# EAGLE design linear supply2 (EAGLE 9.6.2)
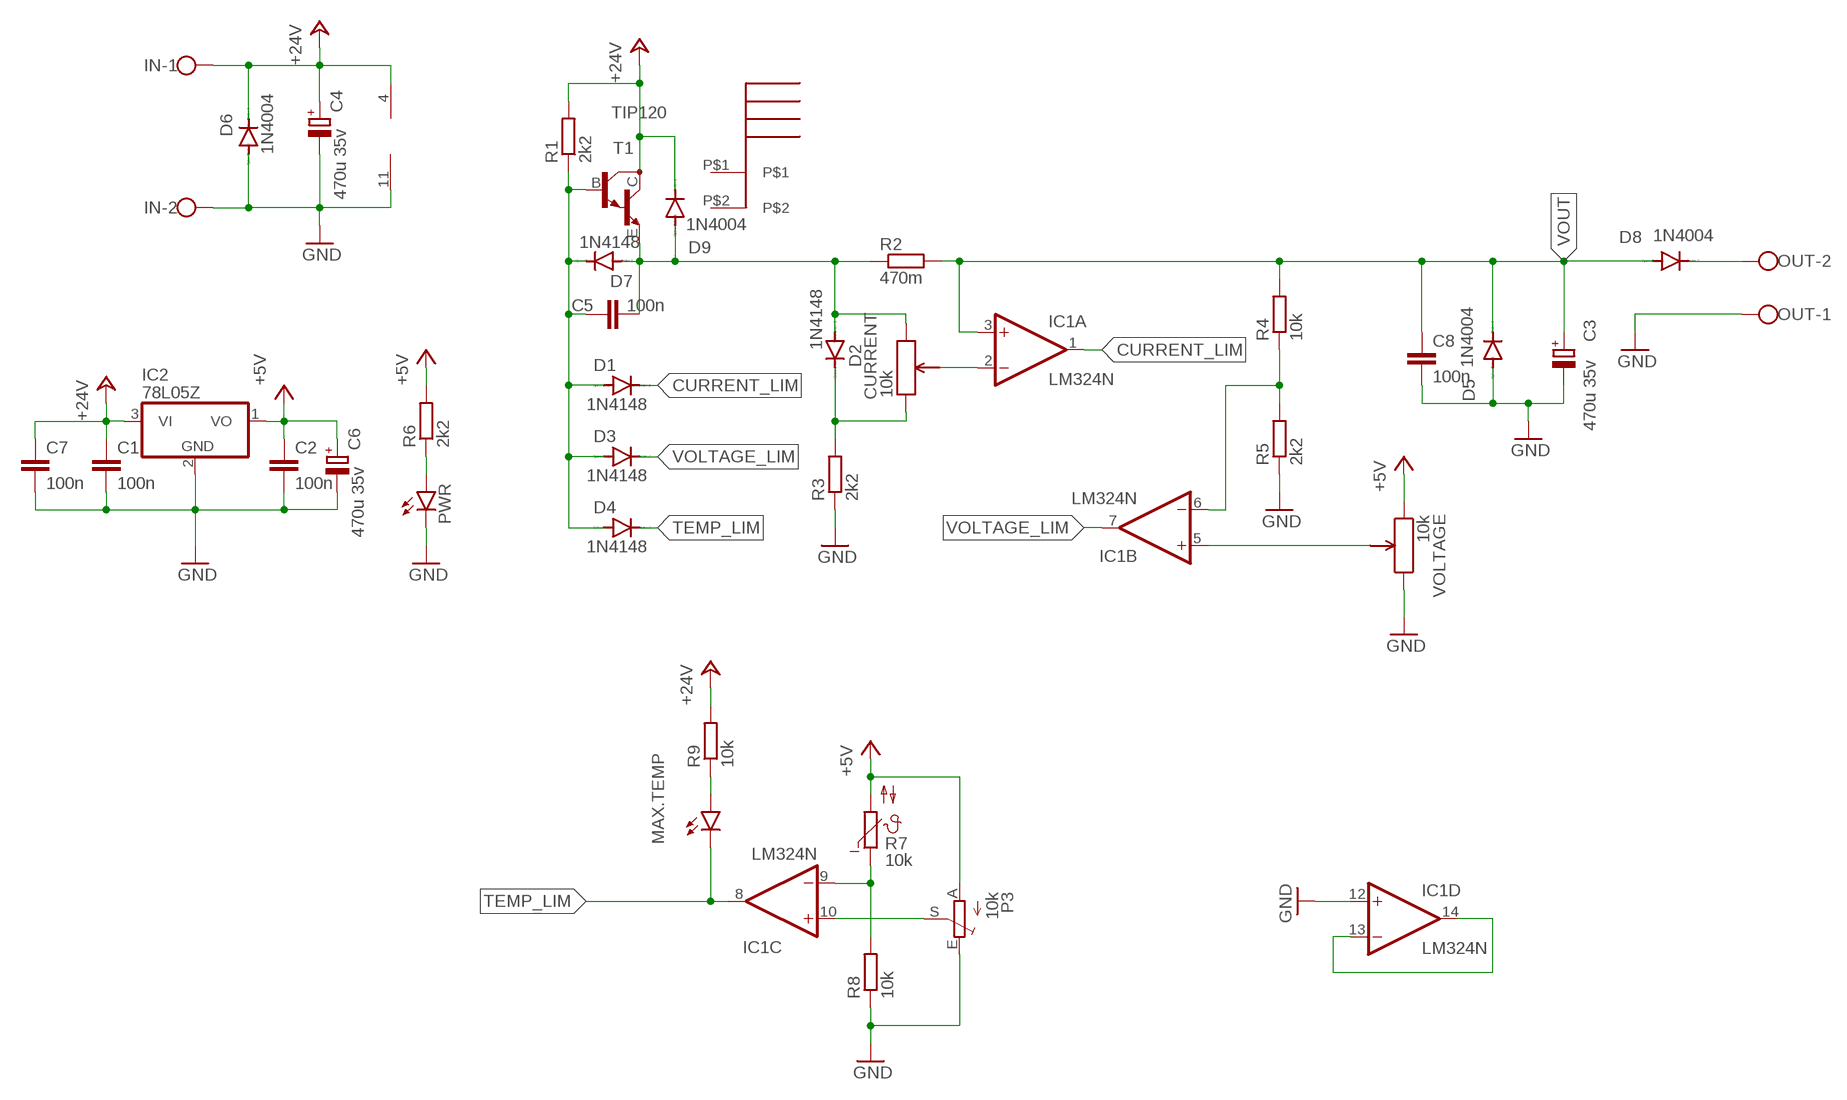
[diagram p0: schematic, sheet 1]

## Parts
C1  100n  C-EU050-024X044  [C050-024X044]
C2  100n  C-EU050-024X044  [C050-024X044]
C3  470u 35v  CPOL-EUE5-10.5  [E5-10,5]
C4  470u 35v  CPOL-EUE5-10.5  [E5-10,5]
C5  100n  C-EU050-024X044  [C050-024X044]
C6  470u 35v  CPOL-EUE5-10.5  [E5-10,5]
C7  100n  C-EUC1206K  [C1206K]
C8  100n  C-EU050-050X075  [C050-050X075]
CURRENT  10k  THRU_PCB_POTKASO1  [THRU_PCW_POT]
D1  1N4148  1N4148DO35-7  [DO35-7]
D2  1N4148  1N4148DO35-7  [DO35-7]
D3  1N4148  1N4148DO35-7  [DO35-7]
D4  1N4148  1N4148DO35-7  [DO35-7]
D5  1N4004  [DO41-10]
D6  1N4004  [DO41-10]
D7  1N4148  1N4148DO35-7  [DO35-7]
D8  1N4004  [DO41-10]
D9  1N4004  [DO41-10]
IC1  LM324N  [DIL14]
IC2  78L05Z  [TO92]
IN  W237-102  [W237-102]
MAX.TEMP  LED3MM  [LED3MM]
OUT  W237-102  [W237-102]
P3  10k  TRIM_EU-CA6V  [CA6V]
PWR  LED3MM  [LED3MM]
R1  2k2  R-EU_0207/10  [0207/10]
R2  470m  R-EU_0411/12  [0411/12]
R3  2k2  R-EU_0207/10  [0207/10]
R4  10k  R-EU_0207/10  [0207/10]
R5  2k2  R-EU_0207/10  [0207/10]
R6  2k2  R-EU_0207/10  [0207/10]
R7  10k  V642  [P642]
R8  10k  R-EU_0207/10  [0207/10]
R9  10k  R-EU_0207/10  [0207/10]
T1  TIP120  BDV65  [SOT93]
U$1  RAD-DY-KY/3  [RAD-DY-KY/3HEATSINK]
VOLTAGE  10k  THRU_PCB_POTKASO1  [THRU_PCW_POT]

## Nets
+5V: C2.1 C6.+ IC2.1(VO) P3.A R6.2 R7.2 VOLTAGE.P$1
+24V: C1.1 C4.+ C7.1 D6.C D9.C IC1.4(P:V+) IC2.3(VI) IN.1 R1.2 R9.2 T1.C
CURRENT_LIM: D1.C IC1.1(A:OUT)
GND: C1.2 C2.2 C3.- C4.- C6.- C7.2 C8.2 D5.A D6.A IC1.11(P:V-) IC1.12(D:+IN) IC2.2(GND) IN.2 OUT.1 P3.E PWR.K(C) R3.1 R5.1 R8.1 VOLTAGE.P$3
MAX: CURRENT.P$1 D2.C R3.2
MIN: C5.2 CURRENT.P$3 D2.A D7.A D9.A R2.1 T1.E
N$1: C5.1 D1.A D3.A D4.A D7.C R1.1 T1.B
N$2: D8.C OUT.2
N$4: IC1.9(C:-IN) R7.1 R8.2
N$5: IC1.6(B:-IN) R4.1 R5.2
N$6: PWR.A R6.1
N$7: IC1.5(B:+IN) VOLTAGE.P$2
N$8: IC1.10(C:+IN) P3.S
N$9: CURRENT.P$2 IC1.2(A:-IN)
N$10: MAX.TEMP.A R9.1
N$11: IC1.13(D:-IN) IC1.14(D:OUT)
TEMP_LIM: D4.C IC1.8(C:OUT) MAX.TEMP.K(C)
VOLTAGE_LIM: D3.C IC1.7(B:OUT)
VOUT: C3.+ C8.1 D5.C D8.A IC1.3(A:+IN) R2.2 R4.2
Unconnected: U$1.P$1 U$1.P$2

## Library data of the parts
C1 C2 C5 C7 C8 = rcl:C-EU: CAPACITOR, European symbol; SPICEPREFIX: C
C3 C4 C6 = rcl:CPOL-EU: POLARIZED CAPACITOR, European symbol; SPICEPREFIX: C
CURRENT = SamacSys_Parts:THRU_PCB_POT
D1-D4 D7 = diode:1N4148: DIODE high speed (Philips)
D5 D6 D8 D9 = diode:1N4004: DIODE general purpose rectifier, 1 A
IC1 = linear:LM324: OP AMP
IC2 = linear:78*: Positive VOLTAGE REGULATOR Source: http://cache.national.com/ds/LM/LM78L05.pdf http://www.fairchildsemi.com/ds/LM/LM7805.pdf
IN OUT = con-wago-500:W237-102: WAGO SCREW CLAMP; MPN: 237-102; OC_FARNELL: unknown; OC_NEWARK: 70K9898
MAX.TEMP PWR = led1:LED: LED OSRAM: - CHIPLED LG R971, LG N971, LY N971, LG Q971, LY Q971, LO R971, LY R971 LH N974, LH R974 LS Q976, LO Q976, LY Q976 LO Q996 - Hyper CHIPLED LW Q18S LB Q993, LB Q99A, LB R99A - SideLED LS A670, LO A670, LY A670, LG A670, LP A670 LB A673, LV A673, LT A673, LW A673 LH A674 LY A675 LS A676, LA A676, LO A676, LY A676, LW A676 LS A679, LY A679, LG A679 - Hyper Micro SIDELED® LS Y876, LA Y876, LO Y876, LY Y876 LT Y87S - SmartLED LW L88C, LW L88S LB L89C, LB L89S, LG L890 LS L89K, LO L89K, LY L89K LS L896, LA L896, LO L896, LY L896 - TOPLED LS T670, LO T670, LY T670, LG T670, LP T670 LSG T670, LSP T670, LSY T670, LOP T670, LYG T670 LG T671, LOG T671, LSG T671 LB T673, LV T673, LT T673, LW T673 LH T674 LS T676, LA T676, LO T676, LY T676, LB T676, LH T676, LSB T676, LW T676 LB T67C, LV T67C, LT T67C, LS T67K, LO T67K, LY T67K, LW E67C LS E67B, LA E67B, LO E67B, LY E67B, LB E67C, LV E67C, LT E67C LW T67C LS T679, LY T679, LG T679 LS T770, LO T770, LY T770, LG T770, LP T770 LB T773, LV T773, LT T773, LW T773 LH T774 LS E675, LA E675, LY E675, LS T675 LS T776, LA T776, LO T776, LY T776, LB T776 LHGB T686 LT T68C, LB T68C - Hyper Mini TOPLED® LB M676 - Mini TOPLED Santana® LG M470 LS M47K, LO M47K, LY M47K Source: http://www.osram.convergy.de LUXEON: - LUMILED® LXK2-PW12-R00, LXK2-PW12-S00, LXK2-PW14-U00, LXK2-PW14-V00 LXK2-PM12-R00, LXK2-PM12-S00, LXK2-PM14-U00 LXK2-PE12-Q00, LXK2-PE12-R00, LXK2-PE12-S00, LXK2-PE14-T00, LXK2-PE14-U00 LXK2-PB12-K00, LXK2-PB12-L00, LXK2-PB12-M00, LXK2-PB14-N00, LXK2-PB14-P00, LXK2-PB14-Q00 LXK2-PR12-L00, LXK2-PR12-M00, LXK2-PR14-Q00, LXK2-PR14-R00 LXK2-PD12-Q00, LXK2-PD12-R00, LXK2-PD12-S00 LXK2-PH12-R00, LXK2-PH12-S00 LXK2-PL12-P00, LXK2-PL12-Q00, LXK2-PL12-R00 Source: www.luxeon.com KINGBRIGHT: KA-3528ASYC Source: www.kingbright.com
P3 = pot:TRIM_EU-: POTENTIOMETER
R1-R6 R8 R9 = rcl:R-EU_: RESISTOR, European symbol; SPICEPREFIX: R
R7 = ptc-ntc:V642: VALVO NTC; OC_FARNELL: unknown; OC_NEWARK: unknown
T1 = transistor-neu-to92:BDV65: NPN BIPOLAR DARLINGTON TRANSISTOR
U$1 = SamacSys_Parts:RAD-DY-KY/3
VOLTAGE = SamacSys_Parts:THRU_PCB_POT; SPICEPREFIX: J

## Board
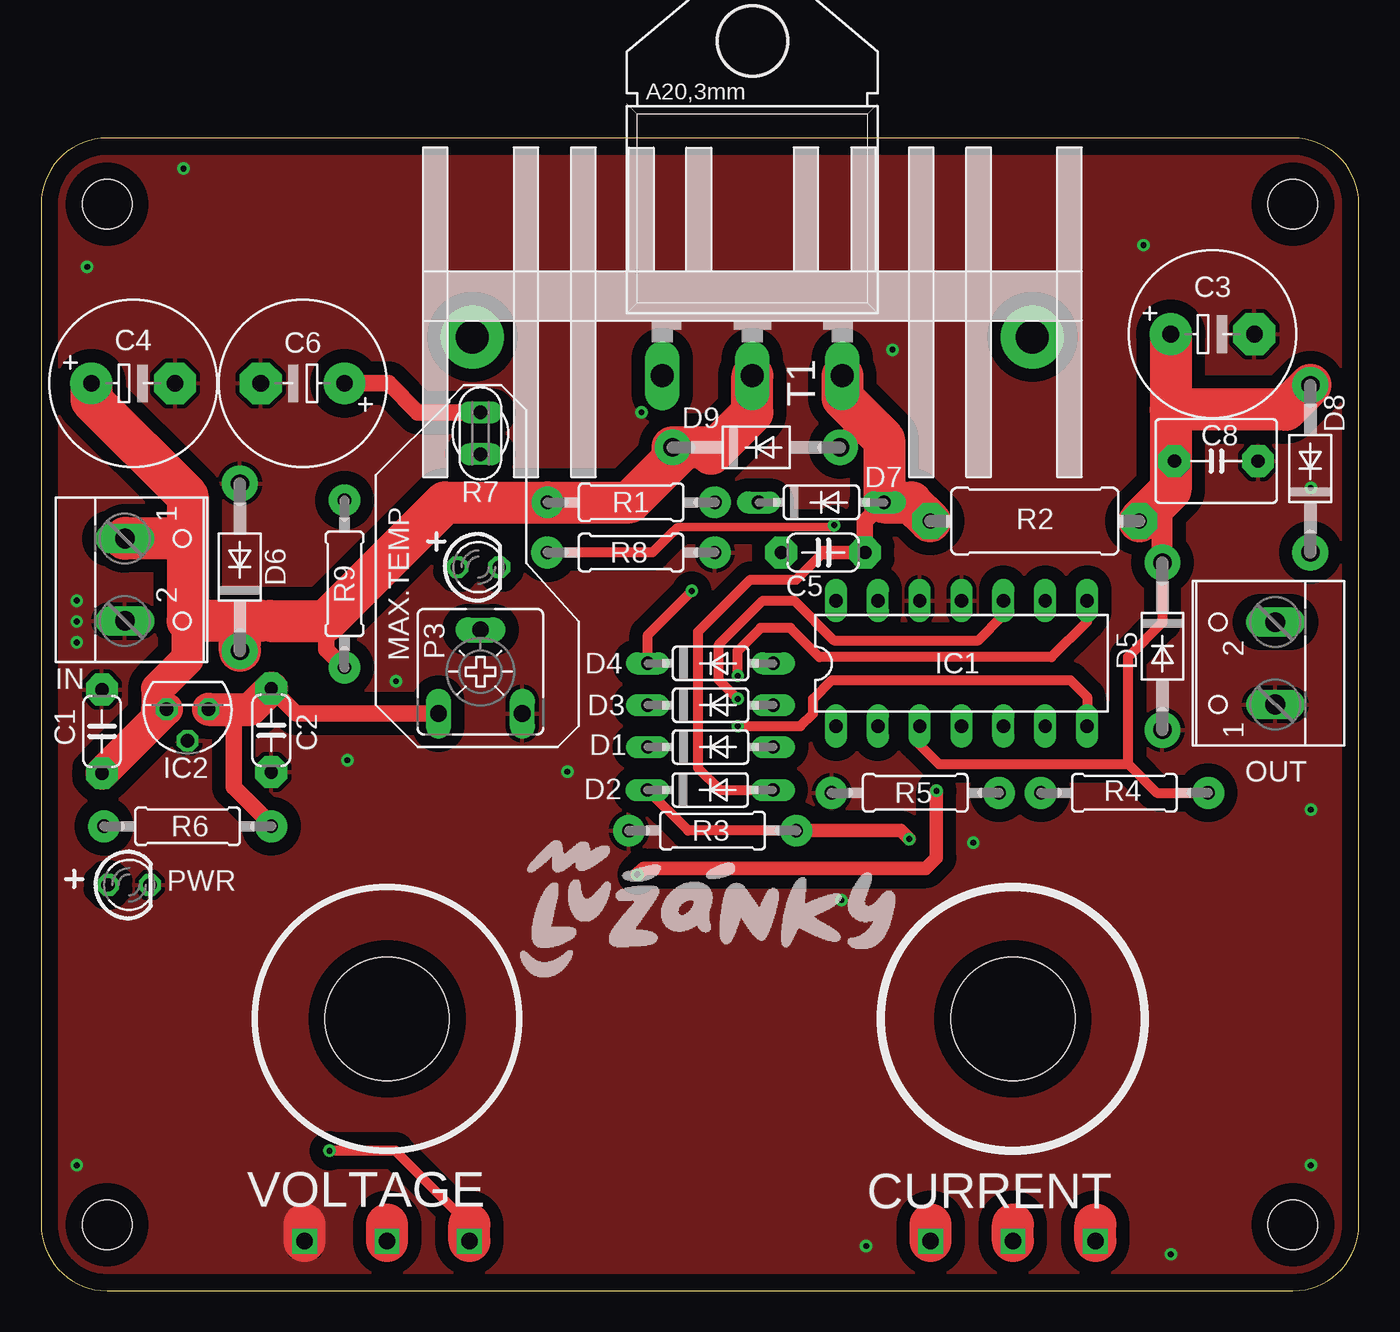
[diagram p1: board, top side]
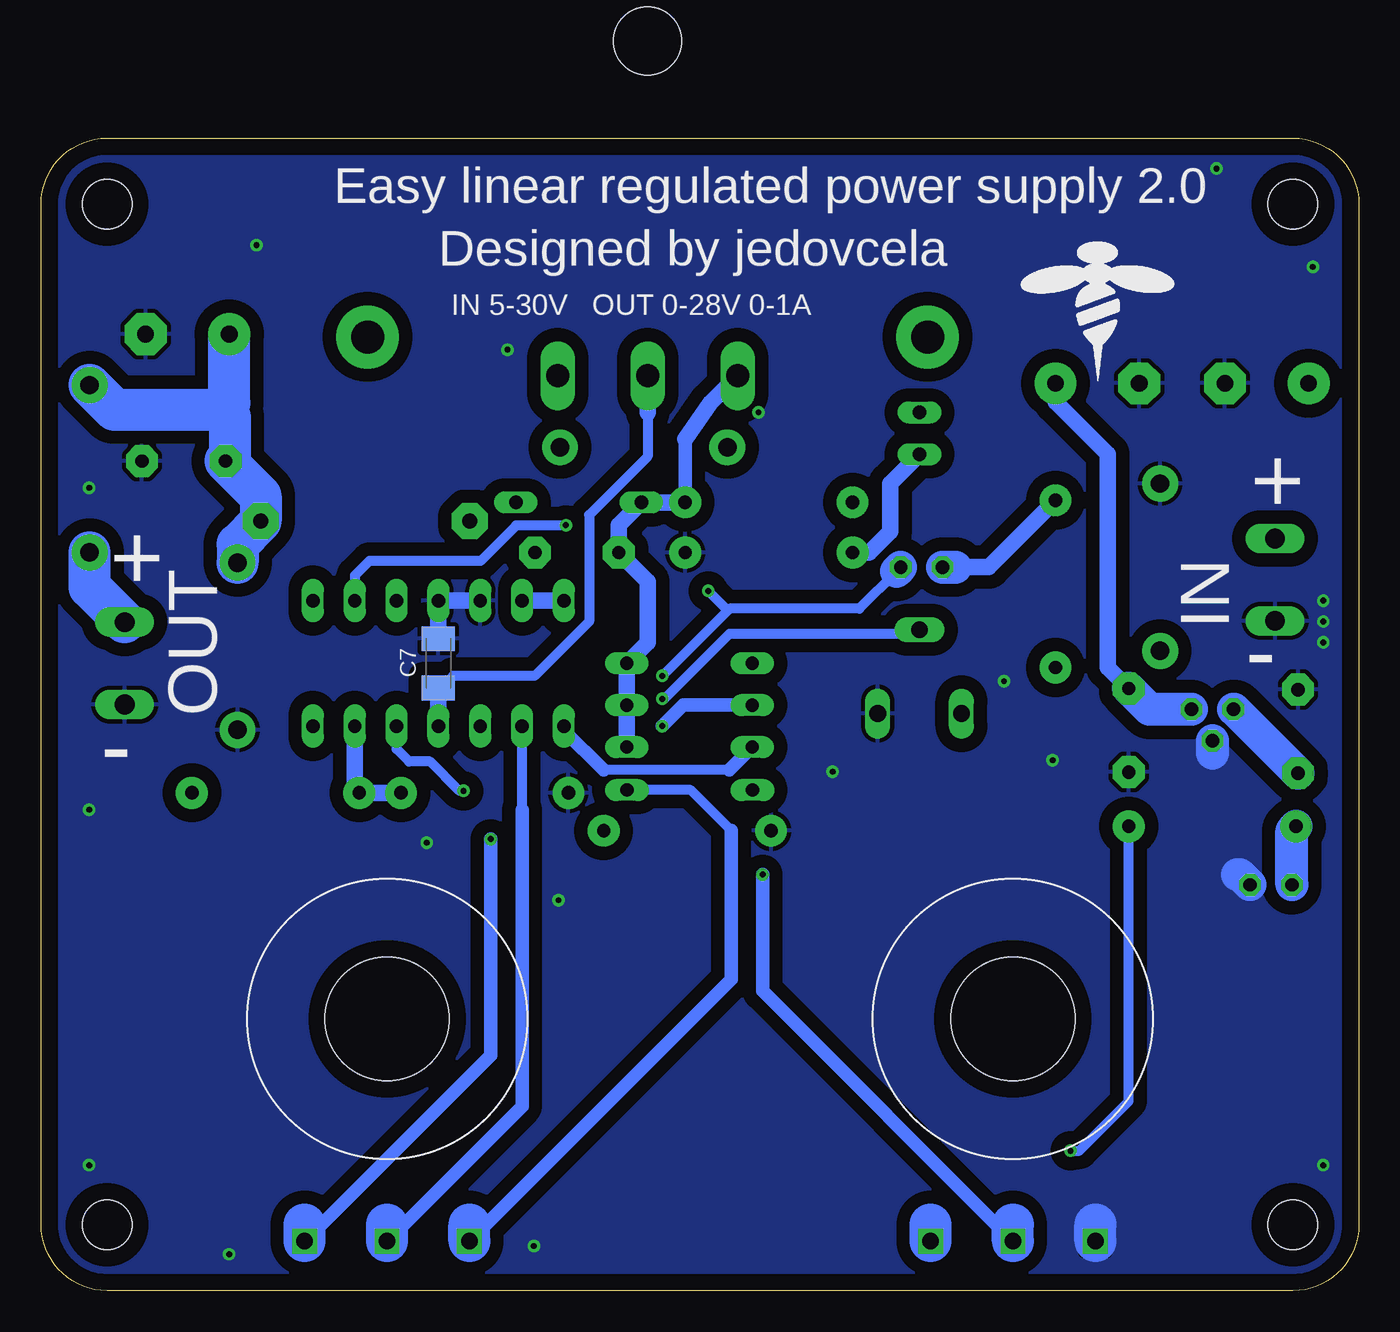
[diagram p2: board, bottom side, seen from below]

Size 80 x 70 mm. Coordinates in mm from the lower left corner, seen from the top.
Outline: 0,66 0,4 arc90 4,0 76,0 arc90 80,4 80,66 arc90 76,70 4,70 arc90 0,66
Copper layers (1*16): Top 0.035mm / dielectric 1.5mm / Bottom 0.035mm
Design rules "default *": minimum track width 6mil, minimum drill 0.35mm, track to track 6mil, track to pad 6mil, pad to pad 6mil, via to via 6mil, smd to smd 6mil, copper to edge 40mil, drill to drill 6mil, minimum pad ring 10mil, minimum via ring 8mil, stop-mask expansion 4mil, vias tented up to drill 15mil, thermal gap 10mil
Holes 3 mm at 4,4 76,4 76,66 4,66

### Footprints (pad centres in the part's own frame; a part is rotated, then mirrored left to right if it is on the bottom)
C050-024X044 = drill 0.813 pad 1.93 octagon: 1 -2.54,0; 2 2.54,0
E5-10,5 = drill 1.016 pad 2.54: + -2.54,0 | drill 1.016 pad 2.54 octagon: - 2.54,0
C1206K = smd 1.5 x 2: 1 -1.5,0; 2 1.5,0
C050-050X075 = drill 0.813 pad 1.93 octagon: 1 -2.54,0; 2 2.54,0
THRU_PCW_POT = drill 1 square: P$1 -5,-13.5; P$2 0,-13.5; P$3 5,-13.5 | hole 7.5: 0,0
DO35-7 = drill 0.813 long: A 3.81,0; C -3.81,0
DO41-10 = drill 1.118 pad 2.184: A 5.08,0; C -5.08,0
DIL14 = drill 0.813 long: 1 -7.62,-3.81; 2 -5.08,-3.81; 3 -2.54,-3.81; 4 0,-3.81; 5 2.54,-3.81; 6 5.08,-3.81; 7 7.62,-3.81; 8 7.62,3.81; 9 5.08,3.81; 10 2.54,3.81; 11 0,3.81; 12 -2.54,3.81; 13 -5.08,3.81; 14 -7.62,3.81
TO92 = drill 0.813 octagon: 1 -1.27,0; 2 0,1.905; 3 1.27,0
W237-102 = drill 1.194 long: 1 -2.5,-1.27; 2 2.5,-1.27
LED3MM = drill 0.813 octagon: A -1.27,0; K 1.27,0
CA6V = drill 1.016 long: A -2.54,-2.54; E 2.54,-2.54; S 0,2.54
0207/10 = drill 0.813 pad 1.93: 1 -5.08,0; 2 5.08,0
0411/12 = drill 0.914 pad 2.184 octagon: 1 -6.35,0; 2 6.35,0
P642 = drill 0.813 long: 1 -1.27,0; 2 1.27,0
SOT93 = drill 1.397 long: B -5.461,-10.16; C 0,-10.16; E 5.461,-10.16 | hole 4.115: 0,10.16
RAD-DY-KY/3HEATSINK = drill 2 pad 3.81: P$1 -17,-0.5; P$2 17,-0.5

### Placement (x,y rotation side)
C1  3.69,33.96 90 top
C2  13.97,34.04 270 top
C3  71.12,58.09 0 top
C4  5.59,55.11 0 top
C5  47.47,44.83 0 top
C6  15.88,55.11 180 top
C7  55.88,38.1 90 bottom
C8  71.34,50.39 0 top
CURRENT  59,16.5 0 bottom
D1  40.64,33.02 0 top
D2  40.62,30.41 0 top
D3  40.64,35.56 0 top
D4  40.64,38.1 0 top
D5  68.08,39.14 270 top
D6  12.06,43.94 90 top
D7  47.37,47.88 0 top
D8  77.06,49.92 90 top
D9  43.42,51.22 0 top
IC1  55.88,38.1 0 top
IC2  8.89,35.31 180 top
IN  6.35,43.18 270 top
MAX.TEMP  26.54,43.94 0 top
OUT  73.66,38.1 90 top
P3  26.67,37.59 0 top
PWR  5.33,24.65 0 top
R1  35.82,47.88 180 top
R2  60.33,46.74 0 top
R3  40.77,27.94 0 top
R4  65.77,30.23 0 top
R5  53.07,30.23 0 top
R6  8.89,28.2 0 top
R7  26.67,52.07 90 top
R8  35.81,44.83 180 top
R9  18.41,42.93 270 top
T1  43.18,65.73 0 top
U$1  43.18,58.42 0 top
VOLTAGE  21,16.5 0 bottom

### Tracks (layer width: path | path; a pad name or v marks a point on that pad's centre or on a via)
+5V  (via drill 0.35)
  Top 0.61: 26,4 21.5,8.5 v17.5,8.5
  Top 1.016: IC2.1 11.68,35.31 | 11.68,35.31 12.7,35.31 | C2.1 15.49,35.05 P3.A | R6.2 13.97,28.32 11.68,30.61 11.68,35.31 | C6.+ 21.09,55.11 22.86,53.34 R7.2
  Top 2: IC2.1 12.7,35.31 C2.1
  Top 2.54: VOLTAGE.P$1 26,4
  Bottom 0.508: 13.97,11.43 13.97,11.5 | 13.97,28 R6.2
  Bottom 0.61: v17.5,8.5 16.97,8.5 13.97,11.5 13.97,28
  Bottom 1.016: C6.+ 18.41,53.98 15.24,50.8 15.24,37.85 C2.1
  Bottom 2: IC2.1 12.7,35.31 C2.1
  Bottom 2.54: VOLTAGE.P$1 26,4
+24V
  Top 0.61: 12.06,39.36 13.38,40.68 | 12,40.68 13.88,40.68
  Top 1.016: 17.31,40.68 17.31,38.95 R9.2
  Top 1.27: D9.C 38.7,50.86
  Top 2: C1.1 7.57,35.31 | 7.57,35.31 7.07,35.31 7.07,36.57 8.89,38.39 8.89,40.68 | 7.57,35.31 IC2.3
  Top 2.54: 13.38,40.68 12,40.68 8.89,40.68 8.89,45.72 | 13.88,40.68 17.31,40.68 24.51,47.88 R1.2 35.72,47.88 38.7,50.86 | D6.C 12.06,39.36 | C4.+ 3.05,54.1 8.89,48.26 8.89,45.72 | IN.1 5.12,45.72 8.89,45.72 | T1.C 43.18,53.34 41.06,51.22 | 40.67,50.83 41.06,51.22 | 41.06,51.22 D9.C
  Bottom 0.61: C7.1 55.73,36.6 54.99,37.34 50.04,37.34 46.74,40.64 46.74,47.12 43.18,50.67 43.18,53.34
  Bottom 1.016: C7.1 IC1.4 | T1.C 43.18,53.34
  Bottom 2: IC2.3 7.57,35.31 C1.1
CURRENT_LIM
  Bottom 0.61: 38.23,31.62 45.85,31.62
  Bottom 0.813: IC1.1 48.26,34.04 45.85,31.62 | D1.C 38.23,31.62
GND  (via drill 0.35)
  Top 2.54: VOLTAGE.P$3 16,4
  Bottom 1.016: C7.2 IC1.11 IC1.12
  Bottom 2: PWR.K 7.23,25.27 7.37,25.27 | IC2.2 8.89,32.64
  Bottom 2.54: VOLTAGE.P$3 16,4
  other vias: 21.55,37.02 2.79,62.18 2.16,41.91 2.16,40.64 2.16,39.37 36.45,53.34 51.69,57.15 66.93,63.5 77.09,48.76 77.09,29.21 8.64,68.15 77.09,7.62 2.16,7.62 31.95,31.51 48.59,23.71 56.59,27.21 50.09,2.71 68.59,2.21 18.59,32.21
  pour Top (isolate 0.813): 0,0 0,69.85 80.01,69.85 80.01,0
  pour Bottom (isolate 0.813): 0,0 0,69.85 80.01,69.85 80.01,0
MAX  (via drill 0.35)
  Top 0.61: R3.2 39.28,27.94 D2.C
  Top 0.813: v52.7,27.43 52.2,27.94 R3.2
  Top 2.54: CURRENT.P$1 64,4
  Bottom 0.813: CURRENT.P$1 52.7,14.29 v52.7,27.43
  Bottom 2.54: CURRENT.P$1 64,4
MIN
  Top 0.61: 47.48,44.83 45.83,43.18 43.05,43.18 39.88,40.01 39.88,31.75 41.22,30.41 D2.A
  Top 0.813: 47.48,44.83 C5.2
  Top 1.016: D7.A 50.01,46.71 C5.2
  Top 1.27: D9.A 49.94,52.66 49.94,52.94
  Top 2.54: R2.1 52.83,47.88 D7.A 51.18,51.69 49.94,52.94 48.64,54.23 T1.E | CURRENT.P$3 54,4
  Bottom 0.61: 38.1,27.94 40.57,30.41 D2.A
  Bottom 0.813: CURRENT.P$3 38.1,18.9 38.1,27.94
  Bottom 2.54: CURRENT.P$3 54,4
N$1
  Bottom 0.813: R1.1 40.9,51.72
  Bottom 1.016: R1.1 D7.C 44.93,46.51 C5.1 43.18,43.08 43.18,39.37 D4.A D3.A D1.A | 40.9,51.72 39.37,53.92 T1.B
N$2
  Bottom 2.54: OUT.2 77.06,42.73 D8.C
N$4  (via drill 0.35)
  Top 0.508: 38.39,46.1 38.66,46.37 48.02,46.37 v48.15,46.5
  Top 0.61: R8.2 37.12,44.83 38.39,46.1
  Bottom 0.61: v48.15,46.5 48.16,46.48 51.16,46.48 53.32,44.32 60.07,44.32 60.96,43.43 IC1.9
  Bottom 1.016: R7.1 28.45,49.02 28.45,46.1 29.72,44.83 R8.2
N$5
  Bottom 1.016: R5.2 R4.1 60.96,30.5 IC1.6
N$6
  Bottom 2: PWR.A 4.06,27.95 R6.1
N$7  (via drill 0.35)
  Top 0.813: v36.2,25.27 36.58,25.65 53.72,25.65 54.36,26.29 v54.36,30.35
  Top 2.54: VOLTAGE.P$2 21,4
  Bottom 0.61: v54.36,30.35 54.61,30.35 56.39,32.13 57.66,32.13 58.42,32.89 IC1.5
  Bottom 0.813: VOLTAGE.P$2 36.2,18.2 v36.2,25.27
  Bottom 2.54: VOLTAGE.P$2 21,4
N$8  (via drill 0.35)
  Top 0.61: v42.29,35.94 41.15,37.08 41.15,39.24 43.81,41.91 45.72,41.91 48.13,39.5 56.9,39.5 58.42,41.02 IC1.10
  Bottom 0.61: v42.29,35.94 42.16,35.94 38.2,39.91 26.89,39.91 P3.S
N$9
  Top 2.54: CURRENT.P$2 59,4
  Bottom 0.61: 50.8,29.21 IC1.2
  Bottom 0.813: CURRENT.P$2 50.8,11.2 50.8,29.21
  Bottom 2.54: CURRENT.P$2 59,4
N$10
  Bottom 1.016: R9.1 22.48,43.94 24.5,43.94
  Bottom 2: MAX.TEMP.A 24.5,43.94
N$11
  Bottom 1.016: IC1.14 IC1.13
TEMP_LIM  (via drill 0.35)
  Top 0.61: v42.29,37.34 42.29,38.86 43.69,40.26 45.5,40.26 45.5,40.23 47.24,38.48 61.34,38.48 63.5,40.64 IC1.8 | D4.C 36.83,39.83 v39.5,42.5
  Bottom 0.61: 28.07,43.69 30.33,41.43 38.2,41.43 38.31,41.31 | 38.31,41.31 v42.29,37.34 | v39.5,42.5 38.31,41.31
  Bottom 2: MAX.TEMP.K 28.07,43.69
VOLTAGE_LIM  (via drill 0.35)
  Top 0.61: IC1.7 63.5,36.07 62.48,37.08 48.01,37.08 46.86,35.94 46.86,35.05 46.1,34.29 v42.29,34.29
  Bottom 0.813: D3.C 41.02,35.56 v42.29,34.29
VOUT
  Top 0.61: D5.C 68.08,40.58 66,38.5 66,31.98 | IC1.3 53.34,33.15 54.51,31.98 66,31.98 | R4.2 67.75,30.23 66,31.98
  Top 1.27: D5.C 68.08,48.14
  Top 2.54: C3.+ 68.58,53.5 | 68.58,53.5 68.58,48.64 68.08,48.14 R2.2 | D8.A 75.56,53.5 68.58,53.5
  Bottom 2.54: D8.A 75.56,53.5 69,53.5 | 69,53.5 68.58,53.92 C3.+ | 69,53.5 68.55,53.05 68.55,50.64 C8.1 66.67,48.26 R2.2 68.08,45.33 D5.C

### Text on the board
tNames: VOLTAGE | CURRENT
bNames: Easy linear regulated power supply 2.0 | Designed by jedovcela | IN 5-30V OUT 0-28V 0-1A | + | IN | + | - | OUT | -